# EAGLE design simple_breakout (EAGLE 6.1)
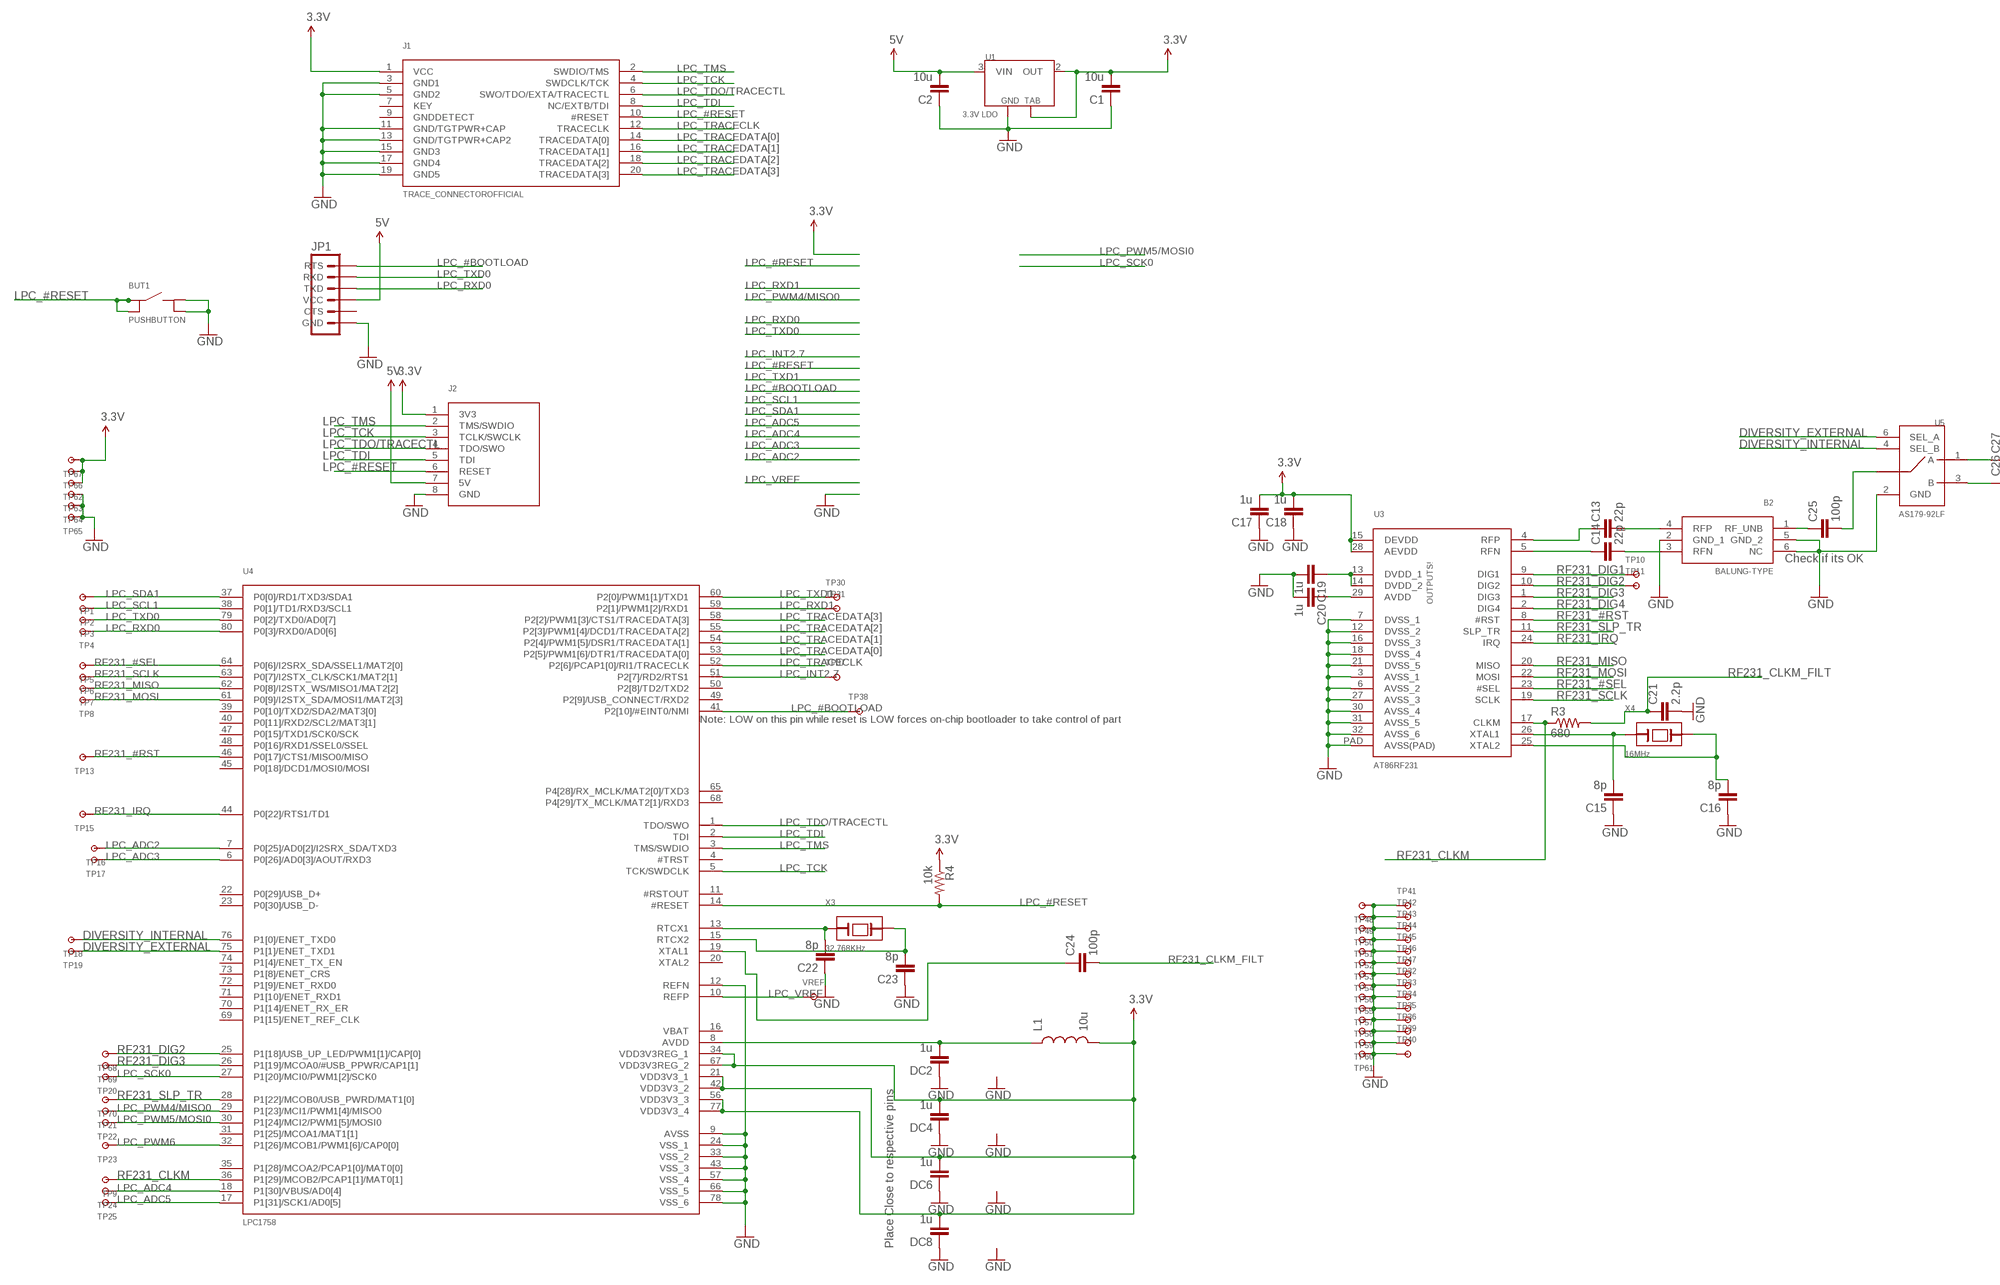
[diagram p0: schematic, sheet 1, part 1 of 2]
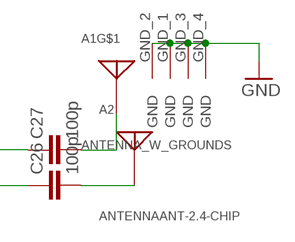
[diagram p1: schematic, sheet 1, part 2 of 2]

## Parts
A1  ANTENNA_W_GROUNDS  [CONREVSMA003.031]
A2  ANTENNAANT-2.4-CHIP  [ANT-2.4-CHP]
B2  BALUNG-TYPE  [MURATA_LDB_BALUN]
BUT1  PUSHBUTTON  [SMT_PUSHBUTTON]
C1  10u  CAP0805  [0805]
C2  10u  CAP0805  [0805]
C13  22p  CAP0402  [C0402]
C14  22p  CAP0402  [C0402]
C15  8p  CAP0402  [C0402]
C16  8p  CAP0402  [C0402]
C17  1u  CAP0402  [C0402]
C18  1u  CAP0402  [C0402]
C19  1u  CAP0402  [C0402]
C20  1u  CAP0402  [C0402]
C21  2.2p  CAP0402  [C0402]
C22  8p  CAP0402  [C0402]
C23  8p  CAP0402  [C0402]
C24  100p  CAP0402  [C0402]
C25  100p  CAP0402  [C0402]
C26  100p  CAP0402  [C0402]
C27  100p  CAP0402  [C0402]
DC2  1u  CAP0402  [C0402]
DC4  1u  CAP0402  [C0402]
DC6  1u  CAP0402  [C0402]
DC8  1u  CAP0402  [C0402]
J1  TRACE_CONNECTOROFFICIAL  [FTSH-110-01-L-DV]
J2  LPCXPRESSO_JTAG  [1X08]
JP1  FTDI_CABLESIP  [1X06]
L1  10u  INDUCTOR0603  [0603]
R3  680  RESISTOR0402  [C0402]
R4  10k  RESISTOR0402  [C0402]
TP1  TESTPOINT100MIL  [TESTPOINT-100MIL]
TP2  TESTPOINT100MIL  [TESTPOINT-100MIL]
TP3  TESTPOINT100MIL  [TESTPOINT-100MIL]
TP4  TESTPOINT100MIL  [TESTPOINT-100MIL]
TP5  TESTPOINT100MIL  [TESTPOINT-100MIL]
TP6  TESTPOINT100MIL  [TESTPOINT-100MIL]
TP7  TESTPOINT100MIL  [TESTPOINT-100MIL]
TP8  TESTPOINT100MIL  [TESTPOINT-100MIL]
TP9  TESTPOINT100MIL  [TESTPOINT-100MIL]
TP10  TESTPOINT100MIL  [TESTPOINT-100MIL]
TP11  TESTPOINT100MIL  [TESTPOINT-100MIL]
TP13  TESTPOINT100MIL  [TESTPOINT-100MIL]
TP15  TESTPOINT100MIL  [TESTPOINT-100MIL]
TP16  TESTPOINT100MIL  [TESTPOINT-100MIL]
TP17  TESTPOINT100MIL  [TESTPOINT-100MIL]
TP18  TESTPOINT100MIL  [TESTPOINT-100MIL]
TP19  TESTPOINT100MIL  [TESTPOINT-100MIL]
TP20  TESTPOINT100MIL  [TESTPOINT-100MIL]
TP21  TESTPOINT100MIL  [TESTPOINT-100MIL]
TP22  TESTPOINT100MIL  [TESTPOINT-100MIL]
TP23  TESTPOINT100MIL  [TESTPOINT-100MIL]
TP24  TESTPOINT100MIL  [TESTPOINT-100MIL]
TP25  TESTPOINT100MIL  [TESTPOINT-100MIL]
TP30  TESTPOINT100MIL  [TESTPOINT-100MIL]
TP31  TESTPOINT100MIL  [TESTPOINT-100MIL]
TP32  TESTPOINTSMALLEST  [TESTPOINT]
TP33  TESTPOINTSMALLEST  [TESTPOINT]
TP34  TESTPOINTSMALLEST  [TESTPOINT]
TP35  TESTPOINTSMALLEST  [TESTPOINT]
TP36  TESTPOINTSMALLEST  [TESTPOINT]
TP37  TESTPOINT100MIL  [TESTPOINT-100MIL]
TP38  TESTPOINT100MIL  [TESTPOINT-100MIL]
TP39  TESTPOINTSMALLEST  [TESTPOINT]
TP40  TESTPOINTSMALLEST  [TESTPOINT]
TP41  TESTPOINTSMALLEST  [TESTPOINT]
TP42  TESTPOINTSMALLEST  [TESTPOINT]
TP43  TESTPOINTSMALLEST  [TESTPOINT]
TP44  TESTPOINTSMALLEST  [TESTPOINT]
TP45  TESTPOINTSMALLEST  [TESTPOINT]
TP46  TESTPOINTSMALLEST  [TESTPOINT]
TP47  TESTPOINTSMALLEST  [TESTPOINT]
TP48  TESTPOINTSMALLEST  [TESTPOINT]
TP49  TESTPOINTSMALLEST  [TESTPOINT]
TP50  TESTPOINTSMALLEST  [TESTPOINT]
TP51  TESTPOINTSMALLEST  [TESTPOINT]
TP52  TESTPOINTSMALLEST  [TESTPOINT]
TP53  TESTPOINTSMALLEST  [TESTPOINT]
TP54  TESTPOINTSMALLEST  [TESTPOINT]
TP55  TESTPOINTSMALLEST  [TESTPOINT]
TP56  TESTPOINTSMALLEST  [TESTPOINT]
TP57  TESTPOINTSMALLEST  [TESTPOINT]
TP58  TESTPOINTSMALLEST  [TESTPOINT]
TP59  TESTPOINTSMALLEST  [TESTPOINT]
TP60  TESTPOINTSMALLEST  [TESTPOINT]
TP61  TESTPOINTSMALLEST  [TESTPOINT]
TP62  TESTPOINT100MIL  [TESTPOINT-100MIL]
TP63  TESTPOINT100MIL  [TESTPOINT-100MIL]
TP64  TESTPOINT100MIL  [TESTPOINT-100MIL]
TP65  TESTPOINT100MIL  [TESTPOINT-100MIL]
TP66  TESTPOINT100MIL  [TESTPOINT-100MIL]
TP67  TESTPOINT100MIL  [TESTPOINT-100MIL]
TP68  TESTPOINT100MIL  [TESTPOINT-100MIL]
TP69  TESTPOINT100MIL  [TESTPOINT-100MIL]
TP70  TESTPOINT100MIL  [TESTPOINT-100MIL]
U1  3.3V LDO  NX1117C  [SOT223]
U3  AT86RF231  [ATRF231_32QN2]
U4  LPC1758  [LPC1758_LQFP80]
U5  AS179-92LF  [SC-70]
VREF  TESTPOINT100MIL  [TESTPOINT-100MIL]
X3  32.768KHz  XTALABS07  [ABS07]
X4  16MHz  XTALCX3225SA  [CX3225SA]

## Nets
3.3V [Power]: C1.2 C17.2 C18.2 DC4.2 DC6.2 DC8.2 J1.1(VCC) J2.1(3V3) L1.2 R4.1 TP62.2 TP66.2 TP67.2 U1.2(OUT) U1.4(TAB) U3.15(DEVDD) U3.28(AEVDD) U4.21(VDD3V3_1) U4.34(VDD3V3REG_1) U4.42(VDD3V3_2) U4.56(VDD3V3_3) U4.67(VDD3V3REG_2) U4.77(VDD3V3_4)
5V [Power]: C2.2 J2.7(5V) JP1.3(VCC) U1.3(VIN)
DIVERSITY_EXTERNAL: TP19.2 U4.75(P1[1]/ENET_TXD1) U5.6(SEL_A)
DIVERSITY_INTERNAL: TP18.2 U4.76(P1[0]/ENET_TXD0) U5.4(SEL_B)
GND [Power]: A1.GND_1 A1.GND_2 A1.GND_3 A1.GND_4 B2.2(GND_1) B2.5(GND_2) B2.6(NC) BUT1.2@1 BUT1.2@2 C1.1 C2.1 C15.1 C16.1 C17.1 C18.1 C19.2 C20.2 C21.2 C22.1 C23.1 DC2.1 DC4.1 DC6.1 DC8.1 J1.3(GND1) J1.5(GND2) J1.11(GND/TGTPWR+CAP) J1.13(GND/TGTPWR+CAP2) J1.15(GND3) J1.17(GND4) J1.19(GND5) J2.8(GND) JP1.1(GND) TP32.P$1 TP33.P$1 TP34.P$1 TP35.P$1 TP36.P$1 TP39.P$1 TP40.P$1 TP41.P$1 TP42.P$1 TP43.P$1 TP44.P$1 TP45.P$1 TP46.P$1 TP47.P$1 TP48.P$1 TP49.P$1 TP50.P$1 TP51.P$1 TP52.P$1 TP53.P$1 TP54.P$1 TP55.P$1 TP56.P$1 TP57.P$1 TP58.P$1 TP59.P$1 TP60.P$1 TP61.P$1 TP63.2 TP64.2 TP65.2 U1.1(GND) U3.3(AVSS_1) U3.6(AVSS_2) U3.7(DVSS_1) U3.12(DVSS_2) U3.16(DVSS_3) U3.18(DVSS_4) U3.21(DVSS_5) U3.27(AVSS_3) U3.30(AVSS_4) U3.31(AVSS_5) U3.32(AVSS_6) U3.PAD(AVSS(PAD)) U4.9(AVSS) U4.12(REFN) U4.24(VSS_1) U4.33(VSS_2) U4.43(VSS_3) U4.57(VSS_4) U4.66(VSS_5) U4.78(VSS_6) U5.2(GND)
LPC_#BOOTLOAD: JP1.6(RTS) TP38.2 U4.41(P2[10]/#EINT0/NMI)
LPC_#RESET: BUT1.1@1 BUT1.1@2 J1.10(#RESET) J2.6(RESET) R4.2 U4.14(#RESET)
LPC_ADC2: TP16.2 U4.7(P0[25]/AD0[2]/I2SRX_SDA/TXD3)
LPC_ADC3: TP17.2 U4.6(P0[26]/AD0[3]/AOUT/RXD3)
LPC_ADC4: TP24.2 U4.18(P1[30]/VBUS/AD0[4])
LPC_ADC5: TP25.2 U4.17(P1[31]/SCK1/AD0[5])
LPC_INT2.7: TP37.2 U4.51(P2[7]/RD2/RTS1)
LPC_PWM4/MISO0: TP21.2 U4.29(P1[23]/MCI1/PWM1[4]/MISO0)
LPC_PWM5/MOSI0: TP22.2 U4.30(P1[24]/MCI2/PWM1[5]/MOSI0)
LPC_PWM6: TP23.2 U4.32(P1[26]/MCOB1/PWM1[6]/CAP0[0])
LPC_RXD0: JP1.4(TXD) TP4.2 U4.80(P0[3]/RXD0/AD0[6])
LPC_RXD1: TP31.2 U4.59(P2[1]/PWM1[2]/RXD1)
LPC_SCK0: TP20.2 U4.27(P1[20]/MCI0/PWM1[2]/SCK0)
LPC_SCL1: TP2.2 U4.38(P0[1]/TD1/RXD3/SCL1)
LPC_SDA1: TP1.2 U4.37(P0[0]/RD1/TXD3/SDA1)
LPC_TCK: J1.4(SWDCLK/TCK) J2.3(TCLK/SWCLK) U4.5(TCK/SWDCLK)
LPC_TDI: J1.8(NC/EXTB/TDI) J2.5(TDI) U4.2(TDI)
LPC_TDO/TRACECTL: J1.6(SWO/TDO/EXTA/TRACECTL) J2.4(TDO/SWO) U4.1(TDO/SWO)
LPC_TMS: J1.2(SWDIO/TMS) J2.2(TMS/SWDIO) U4.3(TMS/SWDIO)
LPC_TRACECLK: J1.12(TRACECLK) U4.52(P2[6]/PCAP1[0]/RI1/TRACECLK)
LPC_TRACEDATA[0]: J1.14(TRACEDATA[0]) U4.53(P2[5]/PWM1[6]/DTR1/TRACEDATA[0])
LPC_TRACEDATA[1]: J1.16(TRACEDATA[1]) U4.54(P2[4]/PWM1[5]/DSR1/TRACEDATA[1])
LPC_TRACEDATA[2]: J1.18(TRACEDATA[2]) U4.55(P2[3]/PWM1[4]/DCD1/TRACEDATA[2])
LPC_TRACEDATA[3]: J1.20(TRACEDATA[3]) U4.58(P2[2]/PWM1[3]/CTS1/TRACEDATA[3])
LPC_TXD0: JP1.5(RXD) TP3.2 U4.79(P0[2]/TXD0/AD0[7])
LPC_TXD1: TP30.2 U4.60(P2[0]/PWM1[1]/TXD1)
LPC_VREF: U4.10(REFP) VREF.2
N$15 [RF]: B2.3(RFN) C14.2
N$16 [RF]: B2.4(RFP) C13.2
N$17 [RF]: C14.1 U3.5(RFN)
N$18 [RF]: C13.1 U3.4(RFP)
N$19: C15.2 U3.26(XTAL1) X4.3(A)
N$20: C16.2 U3.25(XTAL2) X4.1(B)
N$21: C20.1 U3.29(AVDD)
N$22: C19.1 U3.13(DVDD_1) U3.14(DVDD_2)
N$24: DC2.2 L1.1 U4.8(AVDD)
N$25: C22.2 U4.13(RTCX1) X3.1(A)
N$26: C23.2 U4.15(RTCX2) X3.2(B)
N$27: C24.1 U4.19(XTAL1)
N$28 [RF]: B2.1(RF_UNB) C25.1
N$29 [RF]: C25.2 U5.5(W)
N$30 [RF]: A2.CON C26.2
N$31 [RF]: A1.CON C27.2
N$32 [RF]: C26.1 U5.3(B)
N$33 [RF]: C27.1 U5.1(A)
RF231_#RST: TP13.2 U3.8(#RST) U4.46(P0[17]/CTS1/MISO0/MISO)
RF231_#SEL: TP5.2 U3.23(#SEL) U4.64(P0[6]/I2SRX_SDA/SSEL1/MAT2[0])
RF231_CLKM: R3.1 TP9.2 U3.17(CLKM) U4.36(P1[29]/MCOB2/PCAP1[1]/MAT0[1])
RF231_CLKM_FILT: C21.1 C24.2 R3.2
RF231_DIG1: TP10.2 U3.9(DIG1)
RF231_DIG2: TP11.2 TP68.2 U3.10(DIG2) U4.25(P1[18]/USB_UP_LED/PWM1[1]/CAP[0])
RF231_DIG3: TP69.2 U3.1(DIG3) U4.26(P1[19]/MCOA0/#USB_PPWR/CAP1[1])
RF231_DIG4: U3.2(DIG4)
RF231_IRQ: TP15.2 U3.24(IRQ) U4.44(P0[22]/RTS1/TD1)
RF231_MISO: TP7.2 U3.20(MISO) U4.62(P0[8]/I2STX_WS/MISO1/MAT2[2])
RF231_MOSI: TP8.2 U3.22(MOSI) U4.61(P0[9]/I2STX_SDA/MOSI1/MAT2[3])
RF231_SCLK: TP6.2 U3.19(SCLK) U4.63(P0[7]/I2STX_CLK/SCK1/MAT2[1])
RF231_SLP_TR: TP70.2 U3.11(SLP_TR) U4.28(P1[22]/MCOB0/USB_PWRD/MAT1[0])
Unconnected: J1.7(KEY) J1.9(GNDDETECT) JP1.2(CTS) U4.4(#TRST) U4.11(#RSTOUT) U4.16(VBAT) U4.20(XTAL2) U4.22(P0[29]/USB_D+) U4.23(P0[30]/USB_D-) U4.31(P1[25]/MCOA1/MAT1[1]) U4.35(P1[28]/MCOA2/PCAP1[0]/MAT0[0]) U4.39(P0[10]/TXD2/SDA2/MAT3[0]) U4.40(P0[11]/RXD2/SCL2/MAT3[1]) U4.45(P0[18]/DCD1/MOSI0/MOSI) U4.47(P0[15]/TXD1/SCK0/SCK) U4.48(P0[16]/RXD1/SSEL0/SSEL) U4.49(P2[9]/USB_CONNECT/RXD2) U4.50(P2[8]/TD2/TXD2) U4.65(P4[28]/RX_MCLK/MAT2[0]/TXD3) U4.68(P4[29]/TX_MCLK/MAT2[1]/RXD3) U4.69(P1[15]/ENET_REF_CLK) U4.70(P1[14]/ENET_RX_ER) U4.71(P1[10]/ENET_RXD1) U4.72(P1[9]/ENET_RXD0) U4.73(P1[8]/ENET_CRS) U4.74(P1[4]/ENET_TX_EN)

## Notes on the sheet
- Check if its OK
- Note: LOW on this pin while reset is LOW forces on-chip bootloader to take control of part
- Place Close to respective pins

## Library data of the parts
A1 = WSNlib:ANTENNA_W_GROUNDS: 4 Grounds added to antenna symbol
A2 = WSNlib:ANTENNA: Antennas ANT-2.4-CHP-x RPSMA connector
B2 = WSNlib:BALUN
BUT1 = custom:PUSHBUTTON
C1 C2 C13-C27 DC2 DC4 DC6 DC8 = SparkFun:CAP: Capacitor Standard 0603 ceramic capacitor, and 0.1" leaded capacitor.
J1 = WSNlib:TRACE_CONNECTOR: Trace Connector for Cortex-M3
J2 = WSNlib:LPCXPRESSO_JTAG: JTAG pinout for LPCXpresso low-cost programmer
JP1 = custom:FTDI_CABLE: Header 6 Standard 6-pin 0.1" header. Use with straight break away headers (SKU : PRT-00116), right angle break away headers (PRT-00553), swiss pins (PRT-00743), machine pins (PRT-00117), and female headers (PRT-00115). Molex polarized connector foot print use with SKU : PRT-08094 with associated crimp pins and housings. NOTES ON THE VARIANTS LOCK and LOCK_LONGPADS... This footprint was designed to help hold the alignment of a through-hole component (i.e. 6-pin header) while soldering it into place. You may notice that each hole has been shifted either up or down by 0.005 of an inch from it's more standard position (which is a perfectly straight line). This slight alteration caused the pins (the squares in the middle) to touch the edges of the holes. Because they are alternating, it causes a "brace" to hold the component in place. 0.005 has proven to be the perfect amount of "off-center" position when using our standard breakaway headers. Although looks a little odd when you look at the bare footprint, once you have a header in there, the alteration is very hard to notice. Also, if you push a header all the way into place, it is covered up entirely on the bottom side. This idea of altering the position of holes to aid alignment will be further integrated into the Sparkfun Library for other footprints. It can help hold any component with 3 or more connection pins.
L1 = SparkFun:INDUCTOR: Inductors Basic Inductor/Choke - 0603 and 1206. Footprints are not proven and vary greatly between part numbers.
R3 R4 = SparkFun:RESISTOR: Resistor Basic schematic elements and footprints for 0603, 1206, and PTH 1/10th watt (small) resistors.
TP1-TP11 TP13 TP15-TP25 TP30-TP70 VREF = WSNlib:TESTPOINT: Generic Testpoint
U1 = WSNlib:NX1117C: NX1117C LDO Voltage regulator 1A
U3 = WSNlib:AT86RF231: ATRF231 Radio Tranciever
U4 = WSNlib:LPC1758
U5 = WSNlib:AS179-92LF: AS179-92LF 2.4GHz GaAs SPDT Switch
X3 X4 = WSNlib:XTAL: Crystals used in OpenMote

## Net classes
0 default: width 0.152 mm, drill 0.152 mm, clearance 0.152 mm
1 RF: width 0.254 mm, drill 2.54 mm, clearance 0.152 mm
2 Power: width 0.254 mm, drill 0.203 mm, clearance 0.152 mm

## Board
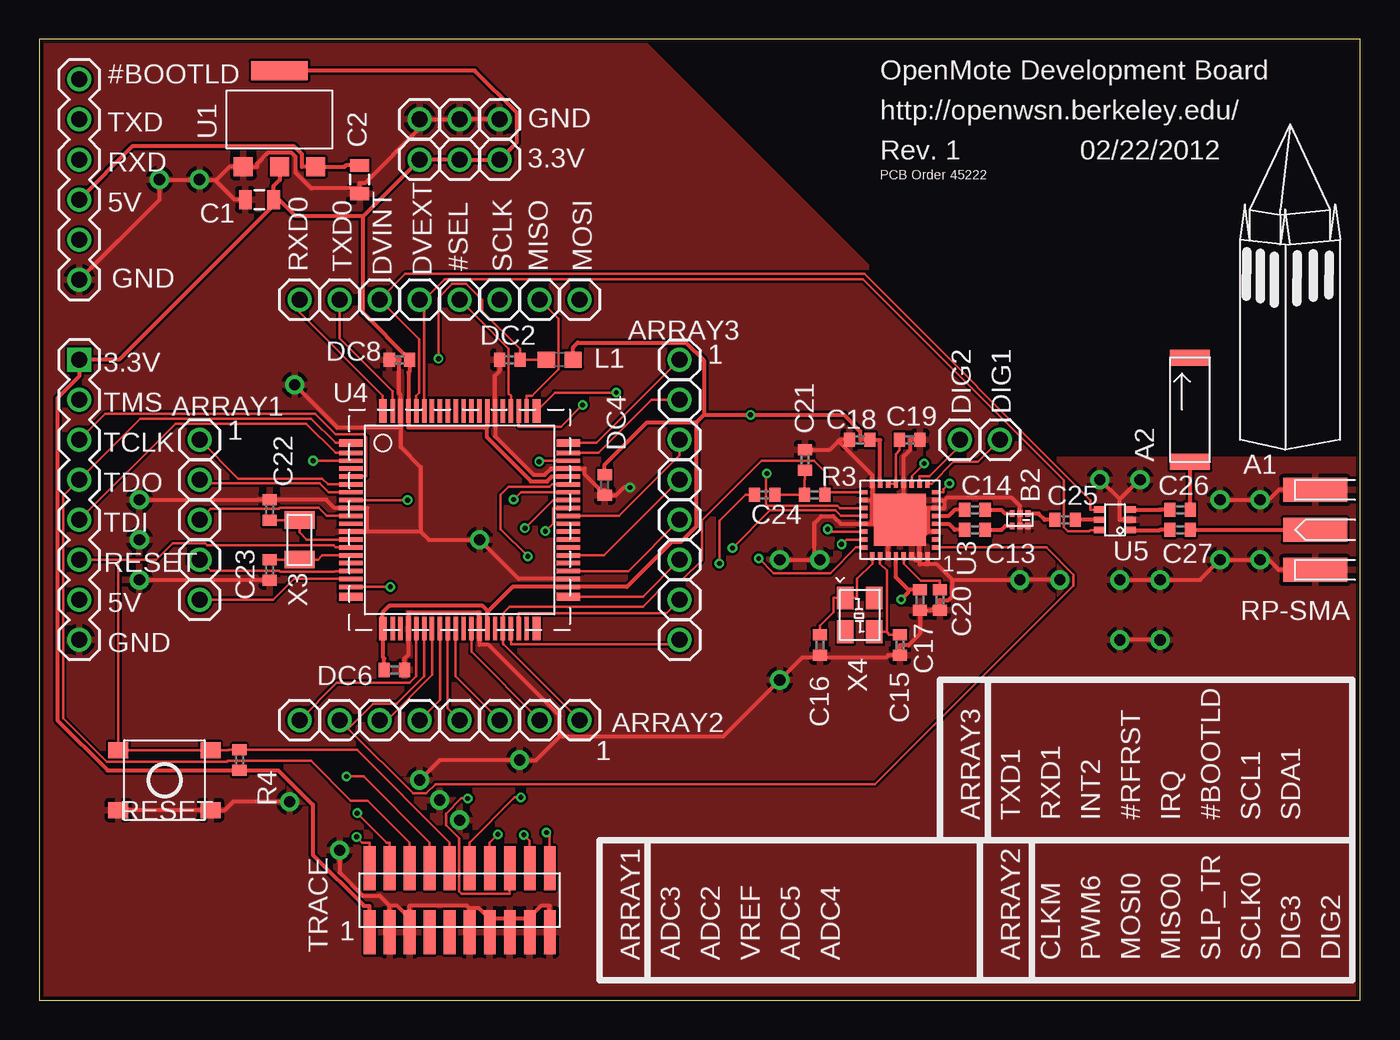
[diagram p2: board, top side]
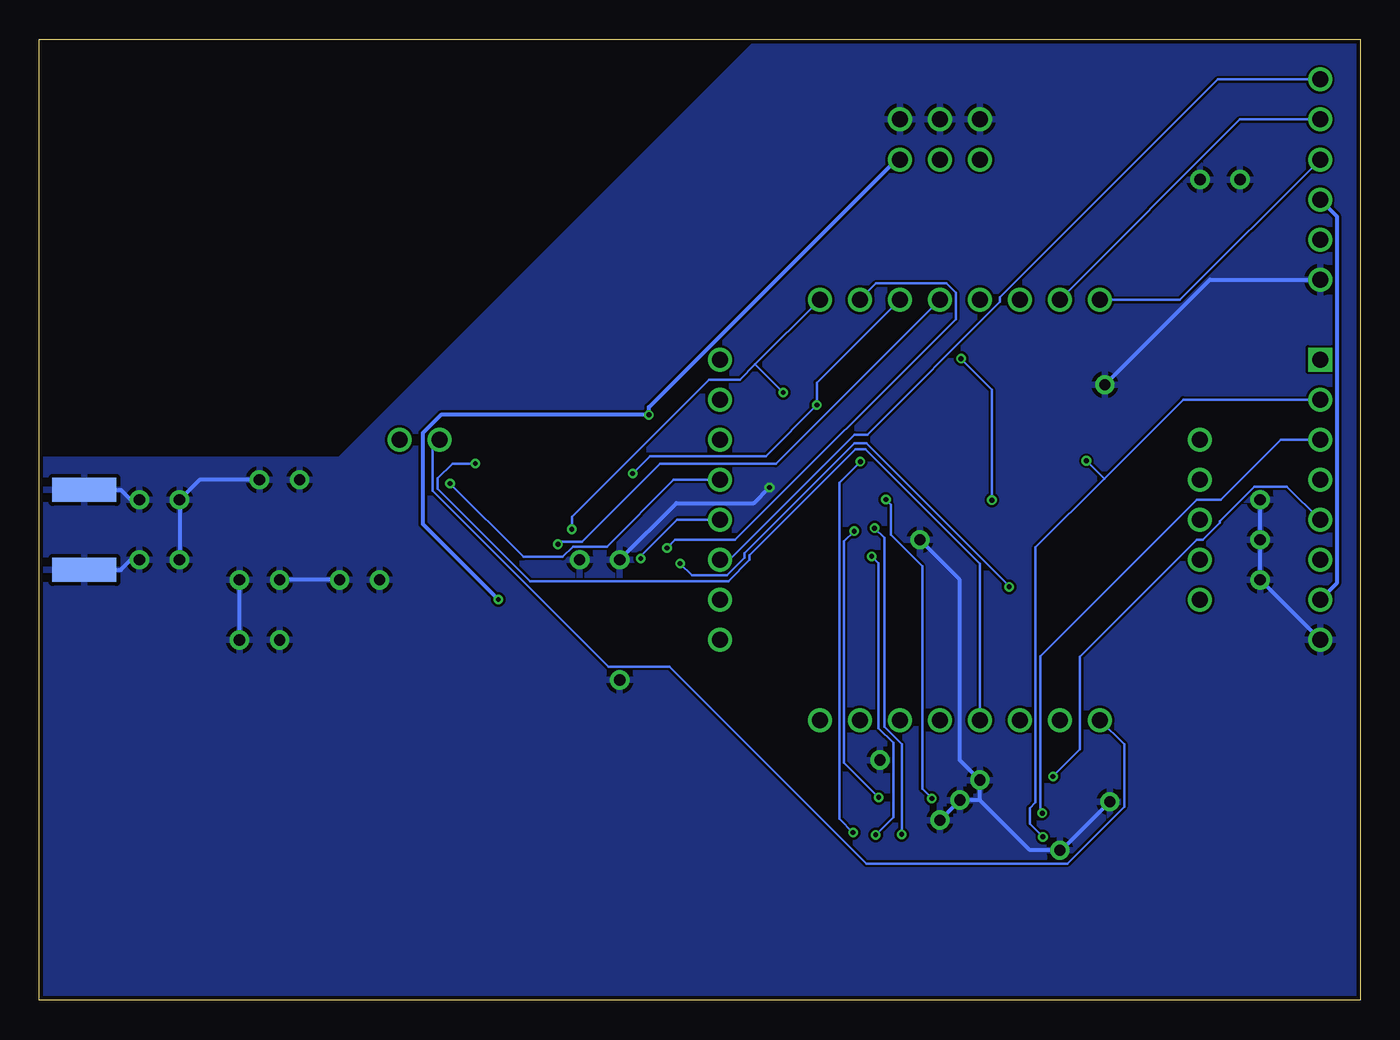
[diagram p3: board, bottom side, seen from below]

Size 83.82 x 60.96 mm. Coordinates in mm from the lower left corner, seen from the top.
Outline: 0,0 83.82,0 83.82,60.96 0,60.96 0,0
Copper layers (1*16): Top 0.035mm / dielectric 1.5mm / Bottom 0.035mm
Design rules: minimum track width 6mil, minimum drill 12mil, track to track 6mil, track to pad 6mil, pad to pad 6mil, via to via 6mil, smd to smd 0mil, copper to edge 10mil, drill to drill 10mil, minimum pad ring 10mil, minimum via ring 6mil, stop-mask expansion 2mil, vias tented up to drill 100mil, thermal gap 10mil

### Footprints (pad centres in the part's own frame; a part is rotated, then mirrored left to right if it is on the bottom)
CONREVSMA003.031 = smd 1.524 x 4.064: CON 0,0; GND_2 -2.54,0; GND_4 2.54,0 | smd 1.524 x 4.064 bottom: GND_1 -2.54,0; GND_3 2.54,0
ANT-2.4-CHP = smd 1.016 x 2.54: CON -3.302,0; MEC 3.302,0
MURATA_LDB_BALUN = smd 0.4 x 0.3: 1 -0.4,0.5; 2 -0.4,0; 3 -0.4,-0.5; 4 0.4,-0.5; 5 0.4,0; 6 0.4,0.5
SMT_PUSHBUTTON = smd 1.27 x 1.016: 1@1 -2.921,1.905; 1@2 2.921,1.905; 2@1 -2.921,-1.905; 2@2 2.921,-1.905
0805 = smd 0.8 x 1.2: 1 -0.9,0; 2 0.9,0
C0402 = smd 0.7 x 0.9: 1 -0.65,0; 2 0.65,0
FTSH-110-01-L-DV = smd 0.737 x 2.794: 1 -5.715,-2.032; 2 -5.715,2.032; 3 -4.445,-2.032; 4 -4.445,2.032; 5 -3.175,-2.032; 6 -3.175,2.032; 7 -1.905,-2.032; 8 -1.905,2.032; 9 -0.635,-2.032; 10 -0.635,2.032; 11 0.635,-2.032; 12 0.635,2.032; 13 1.905,-2.032; 14 1.905,2.032; 15 3.175,-2.032; 16 3.175,2.032; 17 4.445,-2.032; 18 4.445,2.032; 19 5.715,-2.032; 20 5.715,2.032
1X08 = drill 1.016 square: 1 0,0 | drill 1.016: 2 2.54,0; 3 5.08,0; 4 7.62,0; 5 10.16,0; 6 12.7,0; 7 15.24,0; 8 17.78,0
1X06 = drill 1.016: 1 0,0; 2 2.54,0; 3 5.08,0; 4 7.62,0; 5 10.16,0; 6 12.7,0
0603 = smd 1.1 x 1: 1 -0.85,0; 2 0.85,0
TESTPOINT-100MIL = drill 1.016: 2 0,0
TESTPOINT = drill 0.711 pad 1.016: P$1 0,0
SOT223 = smd 1.2 x 1.2: 1 -2.3,-3; 2 0,-3; 3 2.3,-3 | smd 3.6 x 1.2: 4 0,3.1
ATRF231_32QN2 = smd 0.5 x 0.28: 1 -2.3,1.75; 2 -2.3,1.25; 3 -2.3,0.75; 4 -2.3,0.25; 5 -2.3,-0.25; 6 -2.3,-0.75; 7 -2.3,-1.25; 8 -2.3,-1.75; 17 2.3,-1.75; 18 2.3,-1.25; 19 2.3,-0.75; 20 2.3,-0.25; 21 2.3,0.25; 22 2.3,0.75; 23 2.3,1.25; 24 2.3,1.75 | smd 0.28 x 0.5: 9 -1.75,-2.3; 10 -1.25,-2.3; 11 -0.75,-2.3; 12 -0.25,-2.3; 13 0.25,-2.3; 14 0.75,-2.3; 15 1.25,-2.3; 16 1.75,-2.3; 25 1.75,2.3; 26 1.25,2.3; 27 0.75,2.3; 28 0.25,2.3; 29 -0.25,2.3; 30 -0.75,2.3; 31 -1.25,2.3; 32 -1.75,2.3 | smd 3.3 x 3.3: PAD 0,0
LPC1758_LQFP80 = smd 1.5 x 0.5: 1 -6.9,4.875; 20 -6.9,-4.875; 41 6.9,-4.875; 60 6.9,4.875 | smd 1.5 x 0.28: 2 -6.9,4.25; 3 -6.9,3.75; 4 -6.9,3.25; 5 -6.9,2.75; 6 -6.9,2.25; 7 -6.9,1.75; 8 -6.9,1.25; 9 -6.9,0.75; 10 -6.9,0.25; 11 -6.9,-0.25; 12 -6.9,-0.75; 13 -6.9,-1.25; 14 -6.9,-1.75; 15 -6.9,-2.25; 16 -6.9,-2.75; 17 -6.9,-3.25; 18 -6.9,-3.75; 19 -6.9,-4.25; 42 6.9,-4.25; 43 6.9,-3.75; 44 6.9,-3.25; 45 6.9,-2.75; 46 6.9,-2.25; 47 6.9,-1.75; 48 6.9,-1.25; 49 6.9,-0.75; 50 6.9,-0.25; 51 6.9,0.25; 52 6.9,0.75; 53 6.9,1.25; 54 6.9,1.75; 55 6.9,2.25; 56 6.9,2.75; 57 6.9,3.25; 58 6.9,3.75; 59 6.9,4.25 | smd 0.5 x 1.5: 21 -4.875,-6.9; 40 4.875,-6.9; 61 4.875,6.9; 80 -4.875,6.9 | smd 0.28 x 1.5: 22 -4.25,-6.9; 23 -3.75,-6.9; 24 -3.25,-6.9; 25 -2.75,-6.9; 26 -2.25,-6.9; 27 -1.75,-6.9; 28 -1.25,-6.9; 29 -0.75,-6.9; 30 -0.25,-6.9; 31 0.25,-6.9; 32 0.75,-6.9; 33 1.25,-6.9; 34 1.75,-6.9; 35 2.25,-6.9; 36 2.75,-6.9; 37 3.25,-6.9; 38 3.75,-6.9; 39 4.25,-6.9; 62 4.25,6.9; 63 3.75,6.9; 64 3.25,6.9; 65 2.75,6.9; 66 2.25,6.9; 67 1.75,6.9; 68 1.25,6.9; 69 0.75,6.9; 70 0.25,6.9; 71 -0.25,6.9; 72 -0.75,6.9; 73 -1.25,6.9; 74 -1.75,6.9; 75 -2.25,6.9; 76 -2.75,6.9; 77 -3.25,6.9; 78 -3.75,6.9; 79 -4.25,6.9
SC-70 = smd 0.75 x 0.4: 1 -0.95,0.65; 2 -0.95,0; 3 -0.95,-0.65; 4 0.95,-0.65; 5 0.95,0; 6 0.95,0.65
ABS07 = smd 1.1 x 1.9: 1 -1.25,0; 2 1.25,0
CX3225SA = smd 1.45 x 1.05: 1 -1.075,-0.925; 2 1.075,-0.925; 3 1.075,0.925; 4 -1.075,0.925

### Placement (x,y rotation side)
A1  80.96,29.84 270 top
A2  73.03,37.47 90 top
B2  62.23,30.48 270 top
BUT1  7.94,13.97 0 top
C1  13.97,50.8 0 top
C2  20.32,52.07 90 top
C13  59.37,29.84 0 top
C14  59.37,31.11 0 top
C15  54.61,22.54 90 top
C16  49.53,22.54 90 top
C17  55.88,25.4 90 top
C18  52.07,35.56 0 top
C19  55.24,35.56 0 top
C20  57.15,25.4 270 top
C21  48.58,34.29 90 top
C22  14.61,31.11 270 top
C23  14.61,27.3 90 top
C24  46.04,32.07 0 top
C25  65.09,30.48 0 top
C26  72.39,31.11 0 top
C27  72.39,29.84 0 top
DC2  29.84,40.64 0 top
DC4  35.88,32.7 90 top
DC6  22.54,20.95 180 top
DC8  22.86,40.64 0 top
J1  26.67,6.35 0 top
J2  2.54,40.64 270 top
JP1  2.54,45.72 90 top
L1  33.02,40.64 0 top
R3  49.21,32.07 180 top
R4  12.7,15.24 90 top
TP1  40.64,22.86 0 top
TP2  40.64,25.4 0 top
TP3  19.05,44.45 0 top
TP4  16.51,44.45 0 top
TP5  26.67,44.45 0 top
TP6  29.21,44.45 0 top
TP7  31.75,44.45 0 top
TP8  34.29,44.45 0 top
TP9  34.29,17.78 0 top
TP10  60.96,35.56 0 top
TP11  58.42,35.56 0 top
TP13  40.64,33.02 0 top
TP15  40.64,30.48 0 top
TP16  10.16,33.02 0 top
TP17  10.16,35.56 0 top
TP18  21.59,44.45 0 top
TP19  24.13,44.45 0 top
TP20  21.59,17.78 0 top
TP21  26.67,17.78 0 top
TP22  29.21,17.78 0 top
TP23  31.75,17.78 0 top
TP24  10.16,25.4 0 top
TP25  10.16,27.94 0 top
TP30  40.64,40.64 0 top
TP31  40.64,38.1 0 top
TP32  74.93,31.75 0 top
TP33  77.47,27.94 0 top
TP34  74.93,27.94 0 top
TP35  77.47,31.75 0 top
TP36  69.85,33.02 0 top
TP37  40.64,35.56 0 top
TP38  40.64,27.94 0 top
TP39  67.31,33.02 0 top
TP40  68.58,26.67 0 top
TP41  62.23,26.67 0 top
TP42  71.12,26.67 0 top
TP43  64.77,26.67 0 top
TP44  68.58,22.86 0 top
TP45  46.99,27.94 0 top
TP46  71.12,22.86 0 top
TP47  49.53,27.94 0 top
TP48  6.35,31.75 0 top
TP49  6.35,29.21 0 top
TP50  6.35,26.67 0 top
TP51  19.05,9.53 0 top
TP52  15.88,12.6 0 top
TP53  26.67,11.43 0 top
TP54  25.4,12.7 0 top
TP55  24.13,13.97 0 top
TP56  10.16,52.07 0 top
TP57  7.62,52.07 0 top
TP58  27.94,29.21 0 top
TP59  46.99,20.32 0 top
TP60  30.48,15.24 0 top
TP61  16.19,39.05 0 top
TP62  29.21,53.34 0 top
TP63  26.67,55.88 0 top
TP64  24.13,55.88 0 top
TP65  29.21,55.88 0 top
TP66  26.67,53.34 0 top
TP67  24.13,53.34 0 top
TP68  16.51,17.78 0 top
TP69  19.05,17.78 0 top
TP70  24.13,17.78 0 top
TWR  [SATHER_TOWER]  78.74,41.91 0 top
U1  15.24,55.88 0 top
U3  54.61,30.48 180 top
U4  26.67,30.48 0 top
U5  68.26,30.48 180 top
VREF  10.16,30.48 0 top
X3  16.51,29.21 270 top
X4  52.07,24.45 270 top

### Tracks (layer width: path | path; a pad name or v marks a point on that pad's centre or on a via)
3.3V  (via drill 0.3)
  Top 0.254: 28.48,24.67 28.42,24.61 U4.34 | 28.48,24.67 30.04,26.23 U4.42 37.29,26.23 40.12,29.07 40.7,29.07 41.68,30.05 41.68,36.65 | 28.48,24.67 28.13,25.02 22.21,25.02 21.8,24.61 U4.21 21.8,21.78 21.89,21.68 DC6.2 | 55.15,26.05 54.36,26.84 U3.28 | v54.69,25.42 55.15,25.88 55.15,26.05 | C17.2 55.15,26.05 | L1.2 33.87,41.42 34.17,41.72 41.05,41.72 42.17,40.6 42.17,37.14 | 42.17,37.14 v45.14,37.14 51.06,37.14 52.09,36.11 52.09,35.56 C18.2 53.35,35.56 53.36,35.55 U3.15 | 41.68,36.65 42.17,37.14 | 41.68,36.65 38.55,36.65 35.88,33.98 DC4.2 | 20.54,49.75 TP67.2 TP66.2 TP62.2 30.31,54.44 30.31,56.31 27.63,58.98 U1.4 | 20.54,49.75 20.54,43.61 DC8.2 23.51,40.45 23.51,39.91 23.42,39.82 U4.77 23.42,36.35 28.39,36.35 | 20.54,49.75 16.26,49.75 15.21,50.8 | 15.21,50.8 5.05,40.64 J2.1 2.54,39.6 1.14,38.2 1.14,17.77 4.32,14.59 R4.1 13.06,14.59 13.43,14.59 15.17,14.59 17.35,12.41 17.35,9.24 20.6,6 20.95,6 J1.1 | 15.21,50.8 C1.2 14.87,51.68 15.19,52 15.24,52 U1.2 | 28.39,36.35 28.39,35.74 31.2,32.93 32.23,32.93 32.53,33.23 U4.56 | 28.39,36.35 28.42,36.38 U4.67
  Bottom 0.254: v54.69,25.42 59.49,30.22 59.49,35.98 58.33,37.14 v45.14,37.14 45.14,37.64 29.43,53.34 TP62.2
5V
  Top 0.254: JP1.3 5.91,54.17 16.17,54.17 16.66,53.67 16.66,52.88 U1.3 19.35,52.88 19.44,52.97 C2.2
  Bottom 0.254: JP1.3 1.49,49.75 1.49,26.45 J2.7
DIVERSITY_EXTERNAL
  Top 0.152: 24.42,44.45 25.72,45.75 52.25,45.75 65.02,32.99 65.02,30.02 65.27,29.77 66.65,29.77 66.71,29.83 U5.6 | 24.42,44.45 TP19.2 | 24.42,44.45 24.42,38.36 U4.75
DIVERSITY_INTERNAL
  Top 0.152: U5.4 66.71,31.13 66.71,31.73 52.36,46.08 23.22,46.08 TP18.2 24.11,41.93 24.11,38.55 23.92,38.36 U4.76
GND  (via drill 0.3)
  Top 0.254: 56.38,31.23 55.11,31.23 | 56.38,31.23 56.48,31.23 U3.6 57.44,31.23 57.44,31.73 | 56.38,31.23 56.38,29.73 | 56.38,29.73 55.86,29.21 U3.31 55.86,28.05 55.86,27.91 | U3.3 56.38,29.73 | 53.86,30.48 U3.PAD 55.11,30.98 55.11,31.23 | 52.84,30.48 53.86,30.48 | 53.86,30.48 53.86,28.71 U3.27 | 55.86,27.91 55.62,27.91 U3.30 | 55.86,27.91 55.86,27.65 56.23,27.65 56.36,27.78 | C19.2 55.27,35.56 55.27,34.93 54.86,34.52 U3.12 54.86,31.48 55.11,31.23 | 52.84,30.48 52.84,31.73 | 52.84,30.48 52.84,30.23 U3.21 50.86,30.23 50.37,30.72 49.63,30.72 49.19,30.27 49.19,27.94 | 52.84,31.73 52.86,31.75 52.86,32.25 U3.16 52.86,33.31 50.7,35.47 | 49.53,21.73 48.41,21.73 TP59.P$1 43.4,16.73 33.02,16.73 | 49.53,21.73 53.72,21.73 53.88,21.89 C15.1 54.61,22.52 55.16,22.52 55.88,23.24 C17.1 56.61,24.75 56.84,24.98 57.15,24.98 | v37.48,32.53 37.09,32.53 36.61,32.05 DC4.1 35.88,32.37 35.6,32.37 34.6,33.37 34.6,33.73 U4.57 32.54,33.73 32.46,33.73 32.06,33.33 31.37,33.33 28.92,35.78 U4.66 28.92,39.64 29.2,39.91 DC2.1 | 22.92,36.35 22.92,35.1 24.21,33.82 24.21,29.73 | TP61.P$1 18.89,36.35 22.92,36.35 | 24.21,29.73 24.73,29.21 TP58.P$1 30.42,26.73 U4.43 | 24.21,29.73 20.8,29.73 | 20.8,29.73 20.8,31.23 U4.9 18.74,31.23 18.21,31.77 C22.1 13.88,31.77 13.86,31.75 TP48.P$1 | 20.8,29.73 20.7,29.73 U4.12 | C23.1 13.88,26.66 13.86,26.67 TP50.P$1 | 68.56,31.77 TP39.P$1 | 68.56,31.77 68.56,30.48 U5.2 | TP36.P$1 69.81,33.02 68.56,31.77 | B2.6 62.3,30.08 B2.5 B2.2 62.23,31.36 61.72,31.87 57.58,31.87 57.44,31.73 | 57.15,24.98 57.15,25.38 57.7,25.38 57.94,25.62 57.94,26.67 | C20.2 57.15,24.98 | U3.7 57.44,31.73 | 56.36,27.78 56.36,27.91 U3.32
  Top 0.254: 56.36,27.78 56.36,27.65 56.96,27.65 57.94,26.67 | C16.1 49.53,21.73 | 33.02,16.73 33.02,18.05 28.52,22.55 27.92,22.55 U4.33 27.92,24.61 23.42,24.61 U4.24 23.42,21.91 23.19,21.68 DC6.1 | 33.02,16.73 31.53,15.24 TP60.P$1 25.4,15.24 TP55.P$1 | 31.11,5.16 J1.17 | 31.11,5.16 31.11,5.28 31.83,6 32.38,6 J1.19 | TP51.P$1 19.05,8.12 20.53,6.64 21.58,6.64 22.23,6 | 31.11,5.16 29.84,5.16 | J1.15 29.84,5.16 | 29.84,5.16 28.57,5.16 | J1.3 22.23,6 | 23.5,5.16 23.5,5.21 22.71,6 22.23,6 | 23.5,5.16 23.5,6 27.14,6 27.3,5.83 | J1.5 23.5,5.16 | 28.57,5.16 27.9,5.83 27.3,5.83 | J1.11 27.3,5.83 | 11.25,52.07 12.06,52.88 U1.1 13.82,52.88 13.82,53.08 14.49,53.76 16,53.76 16.25,53.51 16.25,52.51 17.25,51.51 20.32,51.51 | 11.25,52.07 TP56.P$1 TP57.P$1 7.62,50.8 JP1.1 | 11.25,52.07 11.25,51.94 12.39,50.8 C1.1 | TP52.P$1 12.31,12.6 11.77,12.06 BUT1.2@2 BUT1.2@1 | 49.19,27.94 TP47.P$1 | TP45.P$1 49.19,27.94 | C21.2 50.17,34.94 50.7,35.47 | 57.94,26.67 TP41.P$1 TP43.P$1 | A1.GND_2 78.65,32.38 78.02,31.75 TP35.P$1 TP32.P$1 | 20.32,51.51 20.32,51.85 20.66,51.85 24.13,55.32 TP64.2 TP63.2 TP65.2 | C2.1 20.32,51.51 | 50.7,35.47 50.79,35.56 C18.1 | J1.13 28.57,5.16 | A1.GND_4 78.65,27.3 78.02,27.94 TP33.P$1 TP34.P$1 73.66,26.67 TP42.P$1 TP40.P$1 | TP46.P$1 TP44.P$1 | 22.92,36.35 U4.78 22.92,38.41 22.84,38.49 22.84,40.64 DC8.1 | U3.18 52.84,31.73
  Bottom 0.254: A1.GND_2 78.65,32.38 78.02,31.75 TP35.P$1 | A1.GND_4 78.65,27.3 78.02,27.94 TP33.P$1 | TP34.P$1 TP32.P$1 73.66,33.02 TP36.P$1 | TP43.P$1 TP40.P$1 | TP45.P$1 43.39,31.54 38.47,31.54 v37.48,32.53 | TP61.P$1 9.53,45.72 JP1.1 | 24.13,12.7 TP55.P$1 25.4,15.24 25.4,26.67 TP58.P$1 | 24.13,12.7 20.95,9.53 TP51.P$1 18.95,9.53 TP52.P$1 | 24.13,12.7 TP54.P$1 TP53.P$1 | TP46.P$1 TP42.P$1 | J2.8 TP50.P$1 TP49.P$1 TP48.P$1
  pour Top: 0,0 0,60.96 38.1,60.96 64.77,34.29 83.82,34.29 83.82,0
  pour Bottom: 0,0 0,60.96 38.1,60.96 64.77,34.29 83.82,34.29 83.82,0
LPC_#BOOTLOAD
  Top 0.152: TP38.2 38.3,25.61 U4.41
  Bottom 0.152: TP38.2 40.03,27.94 32.08,35.89 31.28,35.89 22.86,44.31 22.86,44.59 9.03,58.42 JP1.6
LPC_#RESET
  Top 0.152: 5.02,27.94 7.42,27.94 8.47,28.99 10.51,28.99 10.64,28.86 18.66,28.86 18.79,28.73 U4.14 | J2.6 5.02,27.94 | 5.02,27.94 BUT1.1@1 BUT1.1@2 12.01,15.88 12.02,15.89 R4.2 13.38,15.89 20.15,15.89 26.04,10.01 J1.10
LPC_ADC2
  Top 0.152: TP16.2 10.39,32.79 17.8,32.79 18.36,32.23 18.79,32.23 U4.7
LPC_ADC3
  Top 0.152: TP17.2 12.62,33.1 17.96,33.1 18.33,32.73 U4.6
LPC_ADC4
  Top 0.152: U4.18 16.17,26.73 14.84,25.4 TP24.2
LPC_ADC5
  Top 0.152: U4.17 18.79,27.23 18.74,27.18 15.28,27.18 15.23,27.24 10.86,27.24 TP25.2
LPC_INT2.7
  Top 0.152: U4.51 36.79,30.73 40.64,34.58 TP37.2
LPC_PWM4/MISO0
  Top 0.152: U4.29 25.92,18.53 TP21.2
LPC_PWM5/MOSI0
  Top 0.152: U4.30 26.42,20.57 TP22.2
LPC_PWM6
  Top 0.152: U4.32 27.42,22.11 TP23.2
LPC_RXD0
  Top 0.152: U4.80 21.8,38.36 16.51,43.64 TP4.2
  Bottom 0.152: TP4.2 11.43,44.45 JP1.4
LPC_RXD1
  Top 0.152: TP31.2 38.86,38.1 35.49,34.73 34.47,34.73 U4.59
LPC_SCK0
  Top 0.152: TP20.2 22.06,17.78 24.92,20.64 U4.27
LPC_SCL1
  Top 0.152: U4.38 30.42,24.56 39.8,24.56 TP2.2
LPC_SDA1
  Top 0.152: U4.37 29.92,22.6 40.38,22.6 TP1.2
LPC_TCK  (via drill 0.3)
  Top 0.152: U4.5 20.75,33.23 20.75,35.72 20.56,35.91 18.79,35.91 17.5,37.21 4.19,37.21 J2.3 | J1.4 22.23,10.01 22.04,10.01 v20.17,11.87
  Bottom 0.152: J2.3 5.04,35.56 8.85,31.75 10.36,31.75 20.28,21.83 20.28,11.98 v20.17,11.87
LPC_TDI  (via drill 0.3)
  Top 0.152: J2.5 8.64,36.58 16.94,36.58 18.79,34.73 U4.2 | v19.49,14.2 20.57,14.2 24.77,10.01 J1.8
  Bottom 0.152: J2.5 4.65,32.59 6.71,32.59 8.9,30.4 8.9,30.3 9.99,29.21 10.35,29.21 17.78,21.78 17.78,15.91 v19.49,14.2
LPC_TDO/TRACECTL
  Top 0.152: J1.6 23.5,10.01 20.84,12.66 19.77,12.66 17.24,15.19 11.96,15.19 11.91,15.14 4.28,15.14 1.53,17.89 1.53,32.01 J2.4 6.41,36.89 17.26,36.89 18.79,35.35 U4.1
LPC_TMS  (via drill 0.3)
  Top 0.152: v20.13,10.37 20.49,10.01 20.95,10.01 J1.2 | U4.3 v17.37,34.23
  Bottom 0.152: v20.13,10.37 20.97,11.2 20.97,12.19 20.6,12.56 20.6,28.73 16.24,33.1 | 16.24,33.1 11.23,38.1 J2.2 | v17.37,34.23 16.24,33.1
LPC_TRACECLK  (via drill 0.3)
  Top 0.152: v32.11,29.76 32.59,30.24 32.59,31.23 U4.52 | J1.12 27.3,10.01 30.17,12.88 v30.56,12.88
  Bottom 0.152: v30.56,12.88 32.75,15.06 32.75,29.12 v32.11,29.76
LPC_TRACEDATA[0]  (via drill 0.3)
  Top 0.152: v30.81,29.95 32.59,31.73 U4.53 | v29.09,10.53 28.57,10.01 J1.14
  Bottom 0.152: v29.09,10.53 29.09,16.23 30.2,17.34 30.2,29.34 v30.81,29.95
LPC_TRACEDATA[1]  (via drill 0.3)
  Top 0.152: U4.54 30.56,32.23 v30.1,31.77 | J1.16 29.84,6.76 26.78,6.76 26.63,6.91 26.63,10.28 25.8,11.11 25.8,11.83 26.77,12.8 v27.18,12.8
  Bottom 0.152: v27.18,12.8 27.78,13.41 27.78,27.53 29.78,29.53 29.78,31.45 v30.1,31.77
LPC_TRACEDATA[2]  (via drill 0.3)
  Top 0.152: v30.74,10.49 31.11,10.12 J1.18 | v31,28.16 29.28,29.88 29.28,32.08 29.77,32.57 32.38,32.57 32.54,32.73 U4.55
  Bottom 0.152: v31,28.16 30.56,27.72 30.56,17.27 29.63,16.34 29.63,11.6 v30.74,10.49
LPC_TRACEDATA[3]  (via drill 0.3)
  Top 0.152: U4.58 31.77,34.23 v31.71,34.17 | v32.18,10.64 32.38,10.44 J1.20
  Bottom 0.152: v32.18,10.64 33.05,11.51 33.05,32.84 v31.71,34.17
LPC_TXD0
  Top 0.152: U4.79 22.42,38.65 19.05,42.02 TP3.2
  Bottom 0.152: TP3.2 7.62,55.88 JP1.5
LPC_TXD1
  Top 0.152: TP30.2 35.35,35.35 34.34,35.35 U4.60
LPC_VREF
  Top 0.152: VREF.2 10.86,31.18 15.23,31.18 15.28,31.24 17.72,31.24 18.23,30.73 U4.10
N$15
  Top 0.254: B2.3 61.3,30.88 61.07,31.11 C14.2
N$16
  Top 0.254: B2.4 61.3,30.08 61.07,29.84 C13.2
N$17
  Top 0.254: C14.1 58.09,31.11 57.71,30.73 U3.5
N$18
  Top 0.254: C13.1 58.09,29.84 57.71,30.23 U3.4
N$19
  Top 0.152: 53.78,23.37 53.93,23.22 53.93,23.19 C15.2 | X4.3 53.78,23.37 | 53.78,23.37 53.78,27.28 53.36,27.7 U3.26
N$20
  Top 0.152: U3.25 52.86,27.7 51.9,26.74 51.9,25.52 X4.1 50.39,25.52 50.39,24.63 49.53,23.77 C16.2
N$21
  Top 0.152: U3.29 54.86,27.7 55.93,26.63 57.15,26.63 C20.1
N$22
  Top 0.152: C19.1 54.59,34.88 54.36,34.65 U3.13 U3.14
N$24  (via drill 0.3)
  Top 0.152: L1.1 31.39,40.64 DC2.2 30.5,41.32 28.09,43.72 28.09,44.44 27.08,45.45 26.21,45.45 25.33,44.57 v25.33,40.7 | U4.8 v23.37,31.73
  Bottom 0.152: v25.33,40.7 23.37,38.75 v23.37,31.73
N$25
  Top 0.152: U4.13 16.96,29.23 16.51,29.68 X3.1 15.29,30.46 15.28,30.46 C22.2
N$26
  Top 0.152: U4.15 17.96,28.23 17.69,27.96 X3.2 15.29,27.96 15.28,27.95 C23.2
N$27  (via drill 0.3)
  Top 0.152: v43.15,27.71 43.15,30.41 44.81,32.07 C24.1 | U4.19 v22.27,26.23
  Bottom 0.152: v43.15,27.71 42.4,26.95 40.17,26.95 39.06,28.07 39.06,28.38 32.1,35.33 31.33,35.33 22.27,26.27 v22.27,26.23
N$28
  Top 0.254: C25.1 63.81,30.48 63.41,30.88 B2.1
N$29
  Top 0.254: U5.5 C25.2
N$30
  Top 0.254: A2.CON 73.03,33.38 73.04,33.36 C26.2
N$31
  Top 0.254: C27.2 A1.CON
N$32
  Top 0.254: C26.1 71.11,31.11 71.1,31.13 U5.3
N$33
  Top 0.254: C27.1 71.11,29.84 71.1,29.83 U5.1
RF231_#RST  (via drill 0.3)
  Top 0.152: U4.46 35.85,28.23 TP13.2 | v57.75,32.78 57.39,32.42 57.39,32.23 U3.8
  Bottom 0.152: TP13.2 43.56,33.02 47.8,28.79 49.94,28.79 50.61,28.12 53.09,28.12 v57.75,32.78
RF231_#SEL  (via drill 0.3)
  Top 0.152: U3.23 51.21,29.23 v50.91,28.93 | U4.64 29.92,38.36 29.79,38.49 29.79,41.33 TP5.2
  Bottom 0.152: TP5.2 37.09,34.03 44.44,34.03 | 44.44,34.03 | 44.44,34.03 49.38,29.09 50.75,29.09 v50.91,28.93
RF231_CLKM
  Top 0.152: 49.86,32.23 R3.1 | 49.86,32.23 49.86,33.52 49.16,34.22 45.82,34.22 42.04,30.44 42.04,27.92 40.79,26.67 40,26.67 38.31,24.97 29.84,24.97 29.42,24.56 U4.36 29.42,23.09 29.42,22.6 29.47,22.6 TP9.2 | 49.86,32.23 51.83,32.23 U3.17
RF231_CLKM_FILT
  Top 0.152: C24.2 47.27,32.07 R3.2 48.56,33.05 48.58,33.06 C21.1
RF231_DIG1
  Top 0.152: TP10.2 59.57,34.17 58.02,34.17 56.63,32.78 U3.9
RF231_DIG2
  Top 0.152: U4.25 23.92,20.56 23.5,20.14 18.87,20.14 TP68.2 | TP11.2 58.42,35.19 56.48,33.26 55.86,33.26 U3.10
  Bottom 0.152: TP68.2 14.98,16.25 14.98,12.28 18.59,8.67 31.34,8.67 43.82,21.16 47.69,21.16 58.86,32.33 58.86,35.12 TP11.2
RF231_DIG3
  Top 0.152: 19.6,17.23 TP69.2 | U3.1 63.9,28.73 65.62,27.01 65.62,26.31 53.02,13.71 25.14,13.71 24.55,13.12 23.71,13.12 19.6,17.23 | U4.26 24.42,20.57 22.66,18.81 21.19,18.81 19.6,17.23
RF231_IRQ  (via drill 0.3)
  Top 0.152: v45.65,28.03 46.6,27.09 50.19,27.09 51.83,28.73 U3.24 | TP15.2 37.39,27.23 U4.44
  Bottom 0.152: TP15.2 43.34,30.48 45.65,28.17 v45.65,28.03
RF231_MISO  (via drill 0.3)
  Top 0.152: U4.62 30.92,38.36 31.27,38.36 32.95,40.03 32.95,43.25 TP7.2 | v43.99,28.69 46.37,31.08 50.52,31.08 50.87,30.73 U3.20
  Bottom 0.152: TP7.2 30.72,45.48 26.25,45.48 25.66,44.89 25.66,43.22 39.67,29.21 43.47,29.21 v43.99,28.69
RF231_MOSI  (via drill 0.3)
  Top 0.152: U4.61 32.72,38.55 v36.61,38.55 | v50.03,29.88 50.18,29.73 51.83,29.73 U3.22
  Bottom 0.152: 38.4,40.34 v36.61,38.55 | 38.4,40.34 39.37,39.37 41.33,39.37 50.03,30.68 v50.03,29.88 | TP8.2 38.4,40.34
RF231_SCLK  (via drill 0.3)
  Top 0.152: v46.17,33.42 46.11,33.36 46.11,31.51 46.23,31.39 50.64,31.39 50.8,31.23 U3.19 | v34.48,37.77 33.11,36.4 30.42,36.4 U4.63
  Bottom 0.152: v46.17,33.42 45.06,34.53 37.72,34.53 v34.48,37.77 34.48,39.18 TP6.2
RF231_SLP_TR  (via drill 0.3)
  Top 0.152: U3.11 55.36,33.26 v56.16,34.05 | TP70.2 25.42,19.07 U4.28
  Bottom 0.152: v56.16,34.05 57.6,34.05 58.54,33.11 58.54,32.45 52.69,26.6 40.09,26.6 38.75,27.94 38.75,28.25 32.03,34.97 31.4,34.97 24.13,27.7 TP70.2

### Text on the board
tPlace: PCB Order 45222
tNames: #BOOTLD | OpenMote Development Board | http://openwsn.berkeley.edu/ | TXD | GND | RXD | 3.3V | Rev. 1 | 02/22/2012 | 5V | RXD0 | TXD0 | DVINT | DVEXT | #SEL | SCLK | MISO | MOSI | GND | ARRAY3 | 3.3V | 1 | ARRAY1 | TMS | DIG2 | DIG1 | 1 | TCLK | TDO | TDI | RESET | 5V | RP-SMA | GND | ARRAY2 | 1 | RESET | ARRAY3 | TXD1 | RXD1 | INT2 | #RFRST | IRQ | #BOOTLD | SCL1 | SDA1 | TRACE | ARRAY1 | ADC3 | ADC2 | VREF | ADC5 | ADC4 | ARRAY2 | CLKM | PWM6 | MOSI0 | MISO0 | SLP_TR | SCLK0 | DIG3 | DIG2